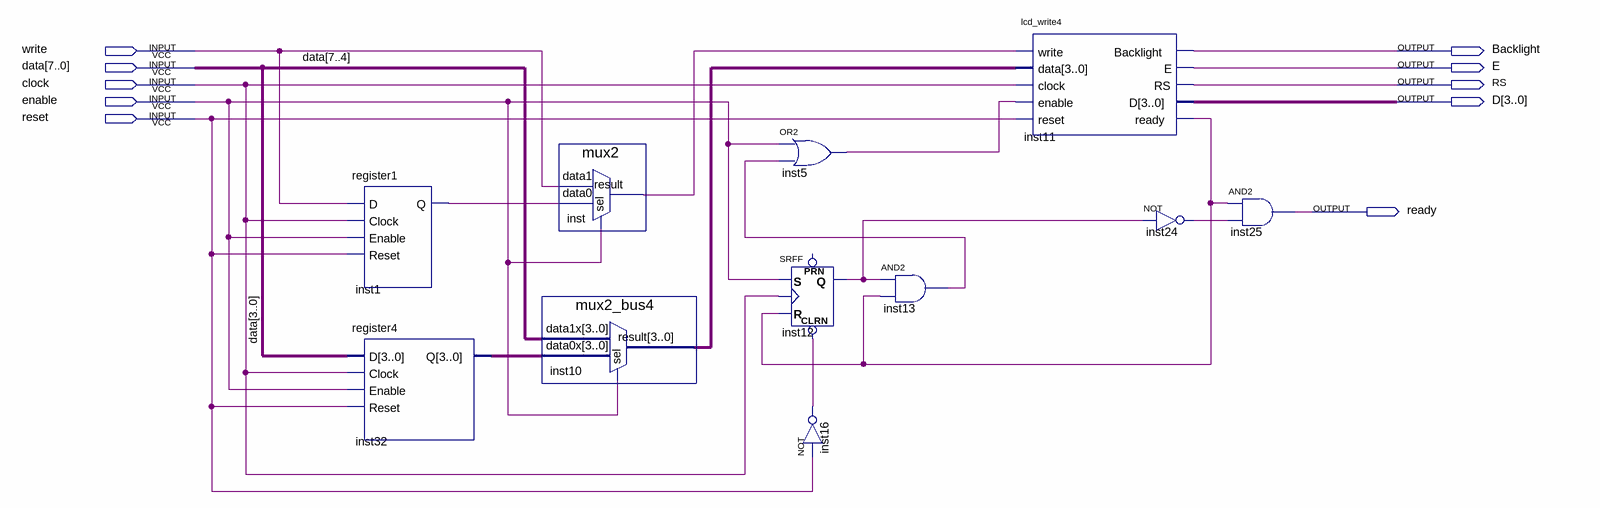
[diagram p0: schematic sheet]
// Quartus schematic lcd_write8.bdf as structural Verilog: 11 symbols, 10 pins
module lcd_write8 (
  input  write,
  input  [7:0] data,
  input  clock,
  input  enable,
  input  reset,
  output Backlight,
  output E,
  output RS,
  output [3:0] D,
  output ready
);

  wire inst1_q, inst5_out, inst11_ready, inst12_q, inst13_out, inst16_out, inst24_out, inst_result;
  wire [3:0] inst10_result, inst32_q;

  register1 inst1 (.D(write), .Clock(clock), .Enable(enable), .Reset(reset), .Q(inst1_q));
  register4 inst32 (.D(data[3:0]), .Clock(clock), .Enable(enable), .Reset(reset), .Q(inst32_q));
  mux2_bus4 inst10 (.data1x(data[7:4]), .data0x(inst32_q), .sel(enable), .result(inst10_result));
  mux2 inst (.data1(write), .data0(inst1_q), .sel(enable), .result(inst_result));
  or inst5 (inst5_out, enable, inst13_out);
  SRFF inst12 (.CLRN(inst16_out), .S(enable), .R(inst11_ready), .CLK(clock), .Q(inst12_q));  // open: PRN
  not inst16 (inst16_out, reset);
  and inst13 (inst13_out, inst12_q, inst11_ready);
  lcd_write4 inst11 (
    .write(inst_result), .data(inst10_result), .clock(clock), .enable(inst5_out), .reset(reset),
    .Backlight(Backlight), .E(E), .RS(RS), .D(D), .ready(inst11_ready));
  not inst24 (inst24_out, inst12_q);
  and inst25 (ready, inst11_ready, inst24_out);
endmodule
